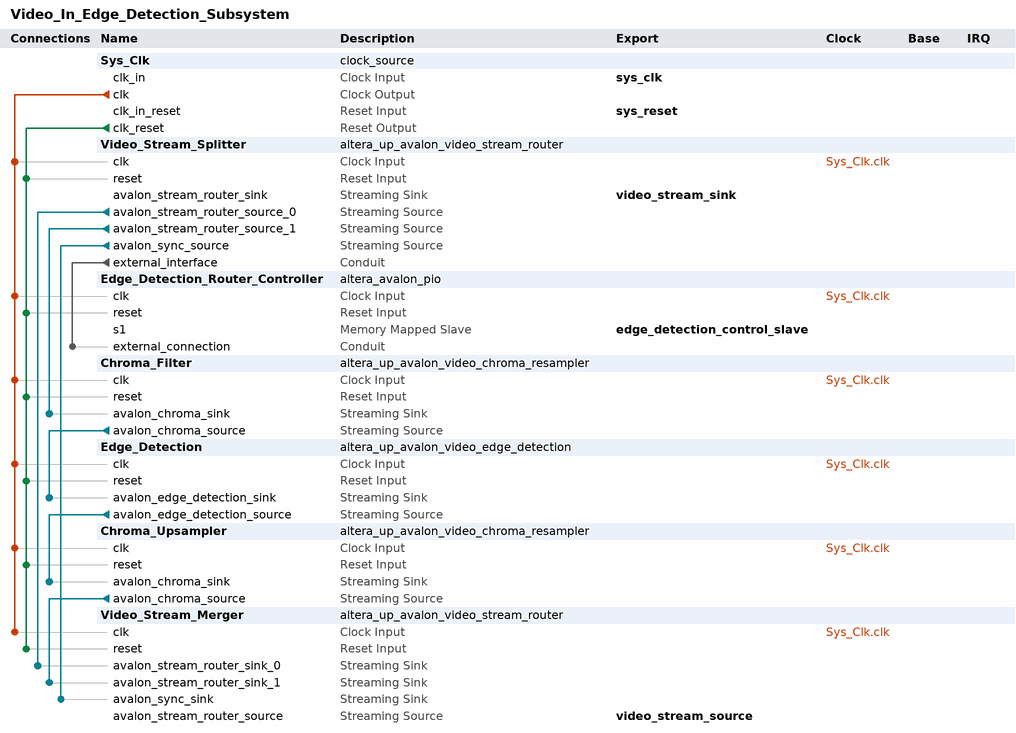
[diagram p0: system contents]
# Platform Designer (Qsys) system Video_In_Edge_Detection_Subsystem, Cyclone IV E EP4CE115F29C8
# Parameters at their usual value, and those the tool derives, are not listed.
package require -exact qsys 18.0
create_system Video_In_Edge_Detection_Subsystem
set_project_property DEVICE_FAMILY {Cyclone IV E}
set_project_property DEVICE EP4CE115F29C8

add_instance Sys_Clk clock_source 18.0
set_instance_parameter_value Sys_Clk clockFrequency 50000000
set_instance_parameter_value Sys_Clk clockFrequencyKnown false

add_instance Video_Stream_Splitter altera_up_avalon_video_stream_router 18.0
set_instance_parameter_value Video_Stream_Splitter color_bits 8
set_instance_parameter_value Video_Stream_Splitter color_planes 3
set_instance_parameter_value Video_Stream_Splitter router_type Split
set_instance_parameter_value Video_Stream_Splitter sync true

add_instance Edge_Detection_Router_Controller altera_avalon_pio 18.0
set_instance_parameter_value Edge_Detection_Router_Controller direction Output
set_instance_parameter_value Edge_Detection_Router_Controller width 1

add_instance Chroma_Filter altera_up_avalon_video_chroma_resampler 18.0
set_instance_parameter_value Chroma_Filter input_type {YCrCb 444}
set_instance_parameter_value Chroma_Filter output_type {Y only}

add_instance Edge_Detection altera_up_avalon_video_edge_detection 18.0
set_instance_parameter_value Edge_Detection intensity 1
set_instance_parameter_value Edge_Detection width 720

add_instance Chroma_Upsampler altera_up_avalon_video_chroma_resampler 18.0
set_instance_parameter_value Chroma_Upsampler input_type {Y only}

add_instance Video_Stream_Merger altera_up_avalon_video_stream_router 18.0
set_instance_parameter_value Video_Stream_Merger color_bits 8
set_instance_parameter_value Video_Stream_Merger color_planes 3
set_instance_parameter_value Video_Stream_Merger router_type Merge
set_instance_parameter_value Video_Stream_Merger sync true

# connections
add_connection Sys_Clk.clk Chroma_Filter.clk clock
add_connection Sys_Clk.clk Chroma_Upsampler.clk clock
add_connection Sys_Clk.clk Edge_Detection.clk clock
add_connection Sys_Clk.clk Edge_Detection_Router_Controller.clk clock
add_connection Sys_Clk.clk Video_Stream_Merger.clk clock
add_connection Sys_Clk.clk Video_Stream_Splitter.clk clock
add_connection Sys_Clk.clk_reset Chroma_Filter.reset reset
add_connection Sys_Clk.clk_reset Chroma_Upsampler.reset reset
add_connection Sys_Clk.clk_reset Edge_Detection.reset reset
add_connection Sys_Clk.clk_reset Edge_Detection_Router_Controller.reset reset
add_connection Sys_Clk.clk_reset Video_Stream_Merger.reset reset
add_connection Sys_Clk.clk_reset Video_Stream_Splitter.reset reset
add_connection Chroma_Filter.avalon_chroma_source Edge_Detection.avalon_edge_detection_sink avalon_streaming
add_connection Chroma_Upsampler.avalon_chroma_source Video_Stream_Merger.avalon_stream_router_sink_1 avalon_streaming
add_connection Edge_Detection.avalon_edge_detection_source Chroma_Upsampler.avalon_chroma_sink avalon_streaming
add_connection Video_Stream_Splitter.avalon_stream_router_source_0 Video_Stream_Merger.avalon_stream_router_sink_0 avalon_streaming
add_connection Video_Stream_Splitter.avalon_stream_router_source_1 Chroma_Filter.avalon_chroma_sink avalon_streaming
add_connection Video_Stream_Splitter.avalon_sync_source Video_Stream_Merger.avalon_sync_sink avalon_streaming
add_connection Video_Stream_Splitter.external_interface Edge_Detection_Router_Controller.external_connection conduit

# exported interfaces
add_interface edge_detection_control_slave avalon slave
set_interface_property edge_detection_control_slave EXPORT_OF Edge_Detection_Router_Controller.s1
add_interface sys_clk clock sink
set_interface_property sys_clk EXPORT_OF Sys_Clk.clk_in
add_interface sys_reset reset sink
set_interface_property sys_reset EXPORT_OF Sys_Clk.clk_in_reset
add_interface video_stream_sink avalon_streaming sink
set_interface_property video_stream_sink EXPORT_OF Video_Stream_Splitter.avalon_stream_router_sink
add_interface video_stream_source avalon_streaming source
set_interface_property video_stream_source EXPORT_OF Video_Stream_Merger.avalon_stream_router_source

set_interconnect_requirement {$system} qsys_mm.clockCrossingAdapter HANDSHAKE
set_interconnect_requirement {$system} qsys_mm.enableEccProtection FALSE
set_interconnect_requirement {$system} qsys_mm.insertDefaultSlave FALSE
set_interconnect_requirement {$system} qsys_mm.maxAdditionalLatency 1

save_system Video_In_Edge_Detection_Subsystem.qsys
